# EAGLE design 117_slideswitch (EAGLE 9.6.2)
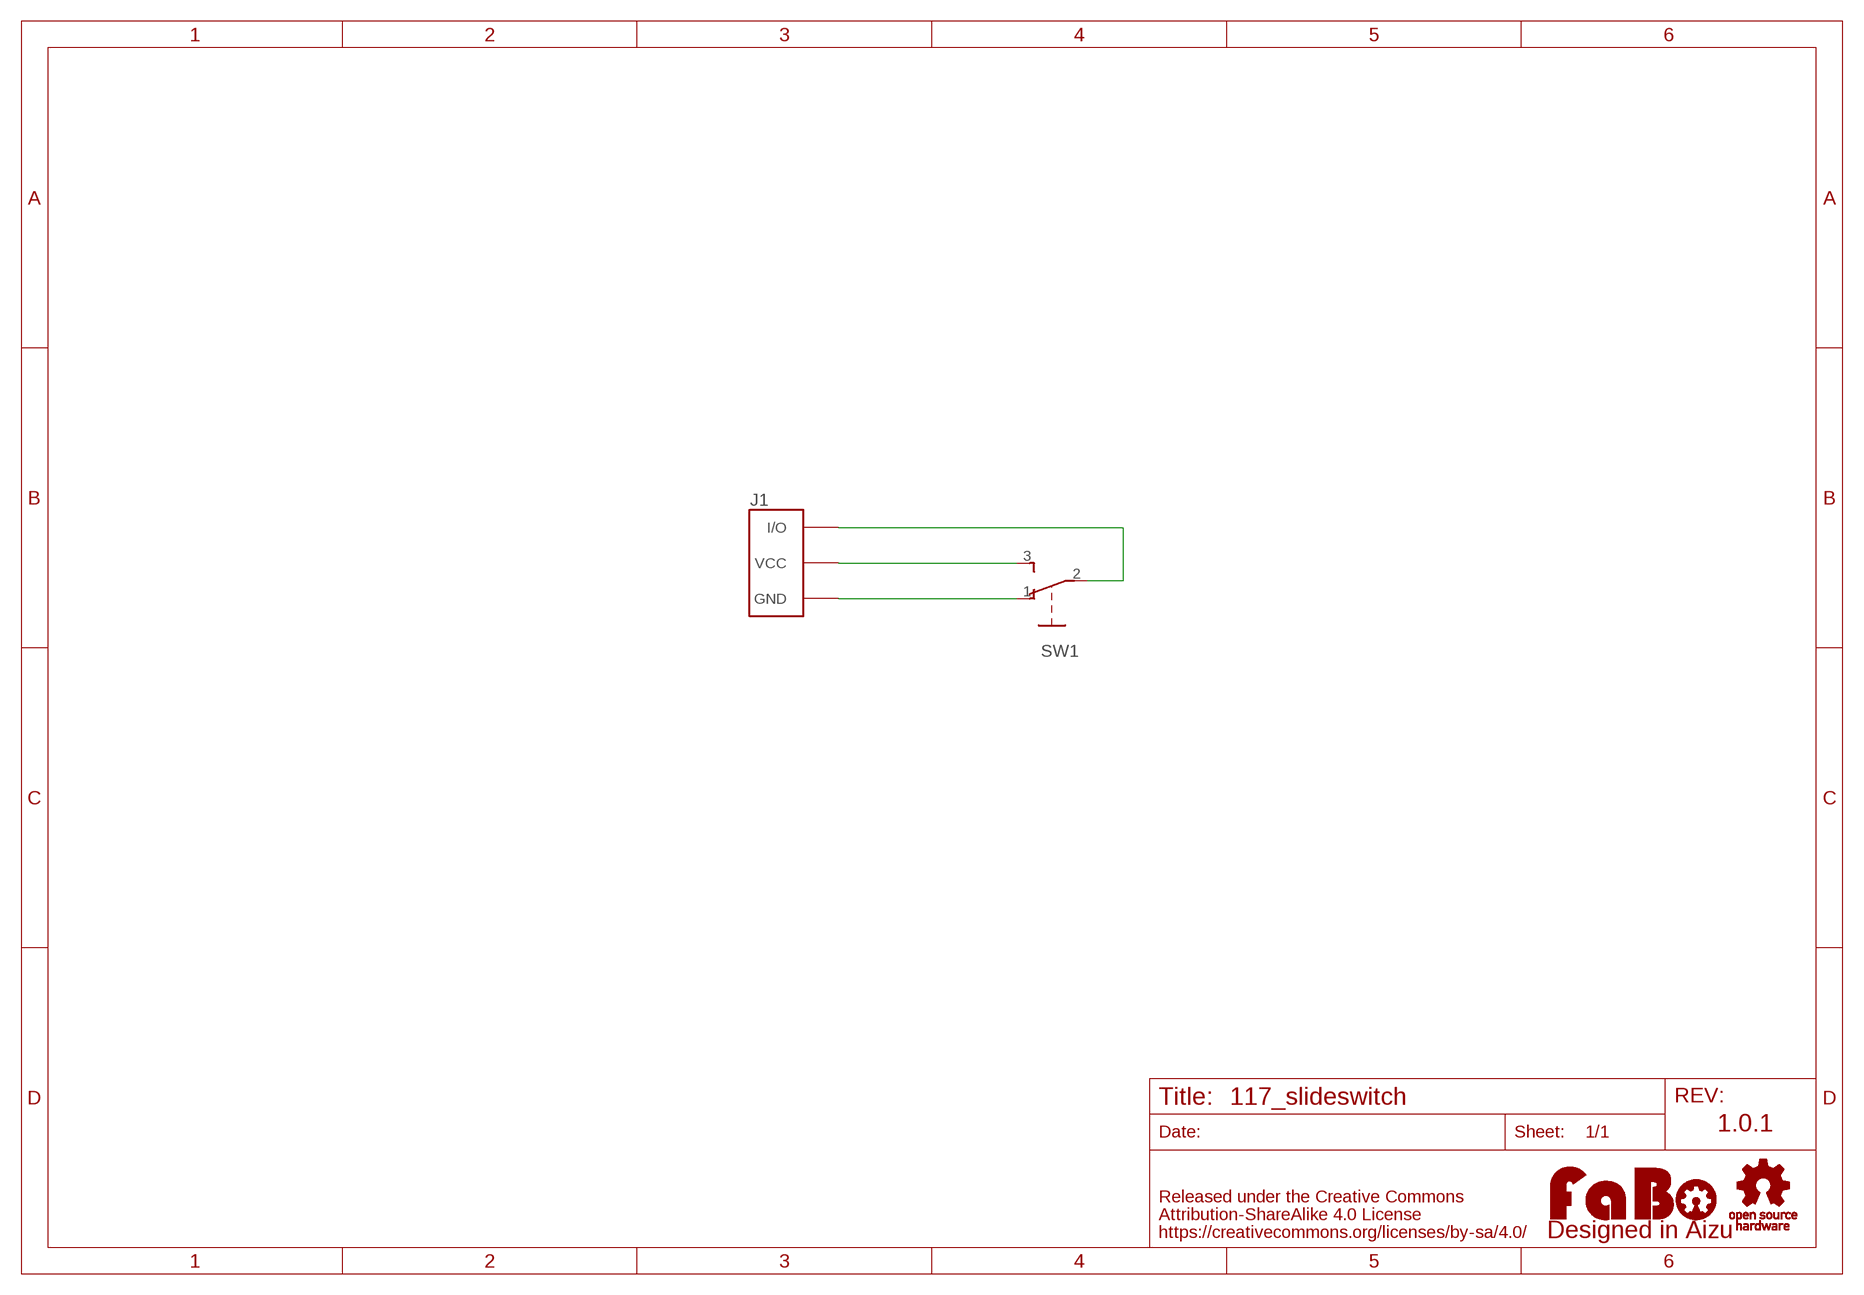
[diagram p0: schematic, sheet 1]

## Parts
J1  FABO_BRICK_3PIN  [FABO_BRICK_3PIN]
LOGO1  LOGO_FABO-M  [LOGO_FABO_M]
SW1  SLIDE  [EG1218]
U$2  LOGO_OSHW-M_BOTTOM  [LOGO_OSHW_M_BOTTOM]

## Nets
GND: J1.GND SW1.1
IO: J1.I/O SW1.2
VCC: J1.VCC SW1.3

## Notes on the sheet
- 1.0.1

## Library data of the parts
J1 = FaBo-Template:FABO_BRICK_3PIN: FaBo Brick 3pin
LOGO1 = component:LOGO_FABO
SW1 = FaBo-Switch:SLIDE
U$2 = FaBo-etc:LOGO_OSHW

## Board
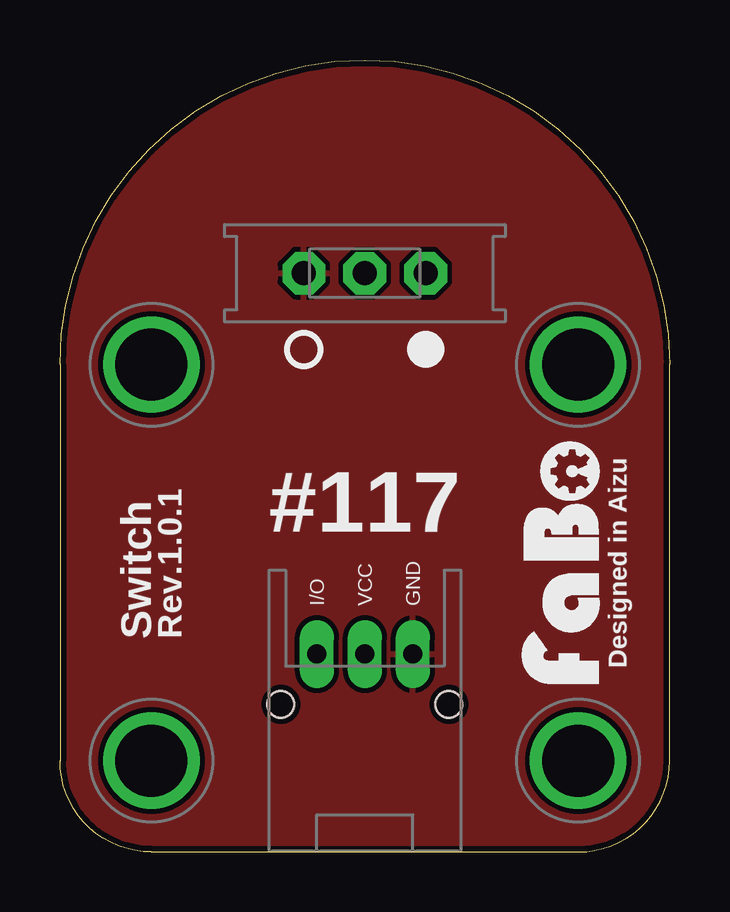
[diagram p1: board, top side]
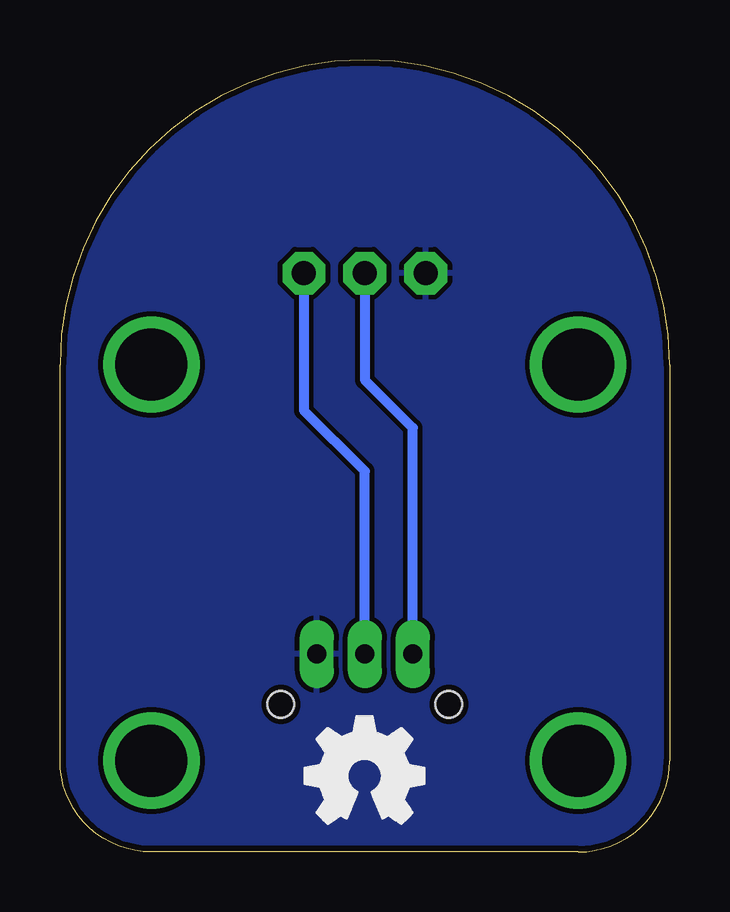
[diagram p2: board, bottom side, seen from below]

Size 25.4 x 33.02 mm. Coordinates in mm from the lower left corner, seen from the top.
Copper layers (1*16): Top 0.035mm / dielectric 1.6mm / Bottom 0.035mm
Design rules "PCBway": minimum track width 6mil, minimum drill 12mil, track to track 6mil, track to pad 6mil, pad to pad 6mil, via to via 6mil, smd to smd 6mil, copper to edge 10mil, drill to drill 10mil, minimum pad ring 10mil, minimum via ring 6mil, stop-mask expansion 2mil, vias tented up to drill 100mil, thermal gap 8mil

### Footprints (pad centres in the part's own frame; a part is rotated, then mirrored left to right if it is on the bottom)
FABO_BRICK_3PIN = drill 0.8 pad 1.422 long: GND 2,-8.255; I/O -2,-8.255; VCC 0,-8.255 | drill 3 pad 3.81: P$1 -8.89,3.81; P$2 8.89,3.81; P$3 -8.89,-12.7; P$4 8.89,-12.7 | hole 1.1: -3.5,-10.355; 3.5,-10.355
EG1218 = drill 1 pad 1.778 octagon: 1 -2.54,0; 2 0,0; 3 2.54,0

### Placement (x,y rotation side)
J1  12.7,16.51 0 top
LOGO1  22.86,12.06 90 top
SW1  12.7,24.13 0 top
U$2  12.7,3.17 0 top

### Tracks (layer width: path | path; a pad name or v marks a point on that pad's centre or on a via)
GND
  pour Bottom (isolate 0.203): 0,0 25.4,0 25.4,33.02 0,33.02
  pour Top (isolate 0.203): 0,0 25.4,0 25.4,33.02 0,33.02
IO
  Bottom 0.406: J1.I/O 10.7,17.68 12.7,19.68 SW1.2
VCC
  Bottom 0.406: J1.VCC 12.7,15.88 15.24,18.41 SW1.3

### Text on the board
tPlace: #117 | Designed in Aizu | Switch | Rev.1.0.1